# Altium schematic sheet Cover.SchDoc
size A3; Date: 08/07/2024; ApprovedBy: SEFA KARA; CheckedBy: SEFA KARA; CompanyName: KONSENS TECH; Engineer: SEFA KARA; Revision: V1.0; SheetNumber: 1; SheetTotal: 4; PreparedBy: SEFA KARA; Project: SECURITY CARD; ReleaseDate: 08/07/2024; ChangedDate: 08/07/2024; RevisionDate: 08/07/2024; PreparedDate: 08/07/2024; CheckedDate: 08/07/2024; ApprovedDate: 08/07/2024; Department: R&D; Rel Date: 08/07/2024; Change Date: 08/07/2024; Rev Date: 08/07/2024; Time: 19:34
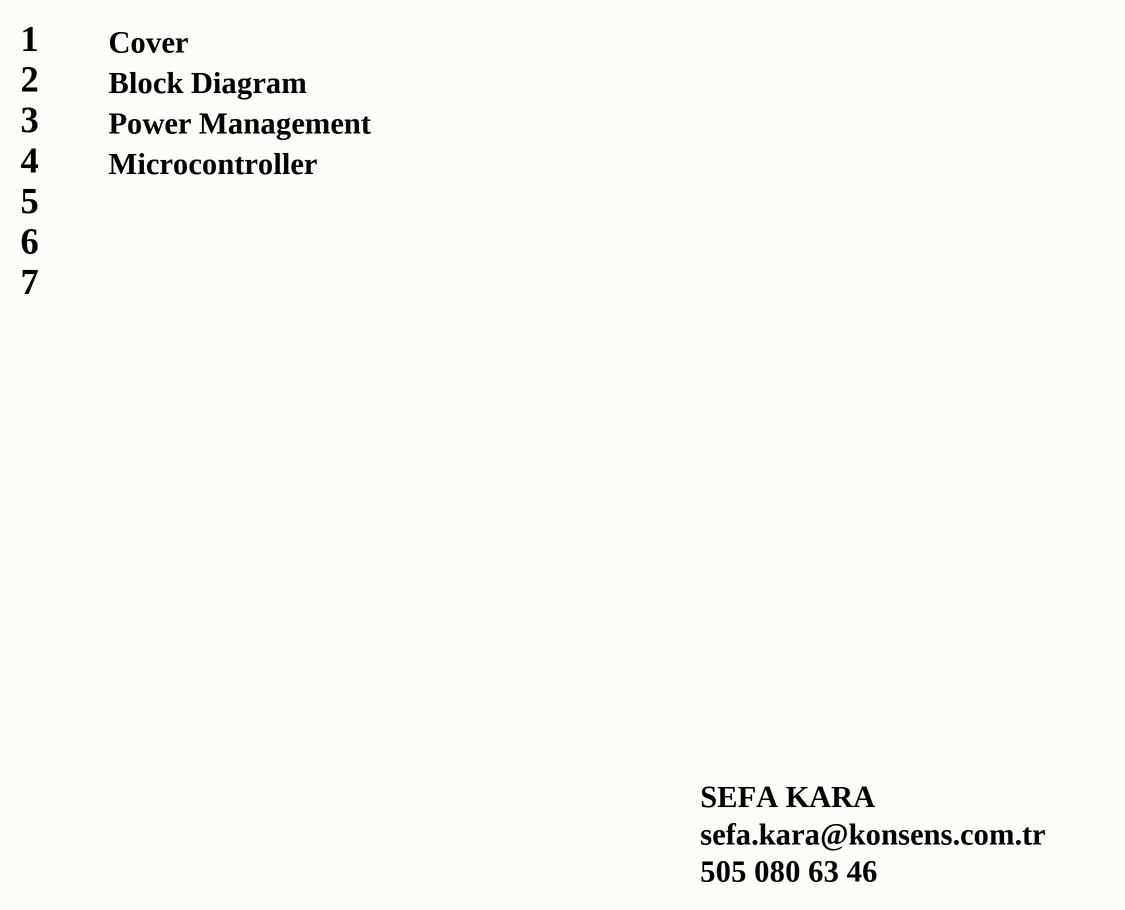
[diagram p0: Cover.SchDoc]

## Notes on the sheet
- 1
- Cover
- 2
- Block Diagram
- 3
- 4
- Power Management
- Microcontroller
- 5
- 6
- 7
- SEFA KARA
- sefa.kara@konsens.com.tr
- 505 080 63 46
- CONTENTS
- REVISION
- PRODUCTION NOTES
- Page No
- Description
- Date
- PROPERTIES
- BOARD
- GERBER
- FILES
- APPENDICES
- CONTACT
- Company Name
- Engineer
- PROJECT
- Rel Date
- FILE NAME
- Checked By
- Approved By
- Rev Date
- Change Date
- Department
- Revision
- Sheet
- of